# Altium project Effects_PSU.PrjPcb
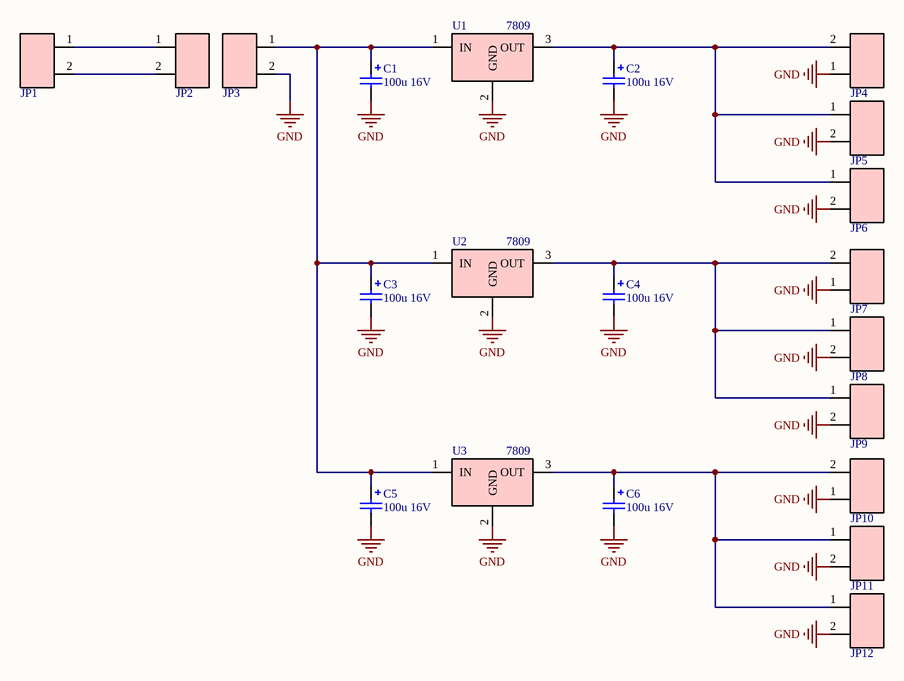
[diagram p0: Effects_PSU.SchDoc]
1 sheet, 21 parts. Net scope: global (net labels, ports and power ports of the same name join across sheets).
Board file: Effects_PSU.PcbDoc

## Sheet Effects_PSU.SchDoc
size A4; SheetNumber: 1; SheetTotal: 1

### Parts
C1  100u 16V  [Capacitor 6.3mm]
C2  100u 16V  [Capacitor 6.3mm]
C3  100u 16V  [Capacitor 6.3mm]
C4  100u 16V  [Capacitor 6.3mm]
C5  100u 16V  [Capacitor 6.3mm]
C6  100u 16V  [Capacitor 6.3mm]
JP1  Mechanical 2pin 1mm  [2 PIN]  (value not drawn)
JP2  Mechanical 2pin 1mm  [2 PIN]  (value not drawn)
JP3  Mechanical 2pin 1mm  [2 PIN]  (value not drawn)
JP4  Mechanical 2pin 1mm  [2 PIN]  (value not drawn)
JP5  Mechanical 2pin 1mm  [2 PIN]  (value not drawn)
JP6  Mechanical 2pin 1mm  [2 PIN]  (value not drawn)
JP7  Mechanical 2pin 1mm  [2 PIN]  (value not drawn)
JP8  Mechanical 2pin 1mm  [2 PIN]  (value not drawn)
JP9  Mechanical 2pin 1mm  [2 PIN]  (value not drawn)
JP10  Mechanical 2pin 1mm  [2 PIN]  (value not drawn)
JP11  Mechanical 2pin 1mm  [2 PIN]  (value not drawn)
JP12  Mechanical 2pin 1mm  [2 PIN]  (value not drawn)
U1  7809  [78xx]
U2  7809  [78xx]
U3  7809  [78xx]

### Nets
GND: C1.2 C2.2 C3.2 C4.2 C5.2 C6.2 JP3.2 JP4.1 JP5.2 JP6.2 JP7.1 JP8.2 JP9.2 JP10.1 JP11.2 JP12.2 U1.2(GND) U2.2(GND) U3.2(GND)
NetC1_1: C1.1 C3.1 C5.1 JP3.1 U1.1(IN) U2.1(IN) U3.1(IN)
NetC2_1: C2.1 JP4.2 JP5.1 JP6.1 U1.3(OUT)
NetC4_1: C4.1 JP7.2 JP8.1 JP9.1 U2.3(OUT)
NetC6_1: C6.1 JP10.2 JP11.1 JP12.1 U3.3(OUT)
NetJP1_1: JP1.1 JP2.1
NetJP1_2: JP1.2 JP2.2

### Library data of the parts
C1-C6 = Capacitor 100u 16V 6.3mm
U1-U3 = IC 7809 TO-220